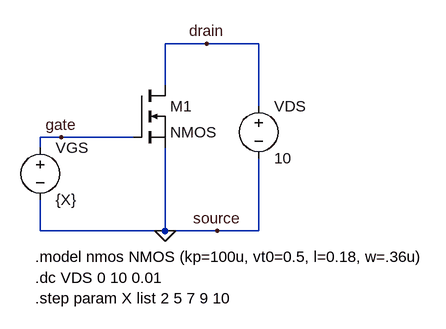
[diagram p0: schematic part2_a_1.asc]
part2_a_1.asc, the LTspice schematic file:
Version 4
SHEET 1 880 680
WIRE 160 48 96 48
WIRE 240 48 160 48
WIRE 96 112 96 48
WIRE 240 144 240 48
WIRE -64 192 -96 192
WIRE 48 192 -64 192
WIRE -96 208 -96 192
WIRE -96 336 -96 288
WIRE 96 336 96 208
WIRE 96 336 -96 336
WIRE 176 336 96 336
WIRE 240 336 240 224
WIRE 240 336 176 336
FLAG 96 336 0
FLAG -64 192 gate
FLAG 160 48 drain
FLAG 176 336 source
SYMBOL voltage -96 192 R0
SYMATTR InstName VGS
SYMATTR Value {X}
SYMBOL voltage 240 128 R0
SYMATTR InstName VDS
SYMATTR Value 10
SYMBOL nmos 48 112 R0
SYMATTR InstName M1
TEXT -104 376 Left 2 !.model nmos NMOS (kp=100u, vt0=0.5, l=0.18, w=.36u)
TEXT -104 408 Left 2 !.dc VDS 0 10 0.01
TEXT -104 440 Left 2 !.step param X list 2 5 7 9 10

The netlist it stands for:
* part2_a_1.asc
VGS gate 0 {X}
VDS drain 0 10
M1 drain gate 0 0 NMOS
.model NMOS NMOS
.model PMOS PMOS
.lib standard.mos
.model nmos NMOS (kp=100u, vt0=0.5, l=0.18, w=.36u)
.dc VDS 0 10 0.01
.step param X list 2 5 7 9 10
.backanno
.end

* Results of the author's LTspice run, read from the files saved beside the schematic
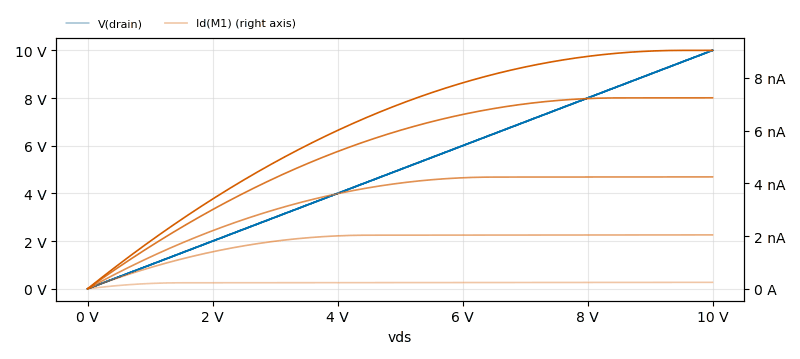
[diagram p1: DC transfer characteristic of part2_a_1.asc, plotted from the saved traces]
* DC transfer characteristic, 5 runs:
*   V(drain) [x=2]: 0 V at vds=0 V, 10 V at vds=10 V, min 0 V, max 10 V
*   V(drain) [x=5]: 0 V at vds=0 V, 10 V at vds=10 V, min 0 V, max 10 V
*   V(drain) [x=7]: 0 V at vds=0 V, 10 V at vds=10 V, min 0 V, max 10 V
*   V(drain) [x=9]: 0 V at vds=0 V, 10 V at vds=10 V, min 0 V, max 10 V
*   V(drain) [x=10]: 0 V at vds=0 V, 10 V at vds=10 V, min 0 V, max 10 V
*   Id(M1) [x=2]: 0 A at vds=0 V, 245 pA at vds=10 V, min 0 A, max 245 pA
*   Id(M1) [x=5]: 0 A at vds=0 V, 2.045 nA at vds=10 V, min 0 A, max 2.045 nA
*   Id(M1) [x=7]: 0 A at vds=0 V, 4.245 nA at vds=10 V, min 0 A, max 4.245 nA
*   Id(M1) [x=9]: 0 A at vds=0 V, 7.245 nA at vds=10 V, min 0 A, max 7.245 nA
*   Id(M1) [x=10]: 0 A at vds=0 V, 9.045 nA at vds=10 V, min 0 A, max 9.045 nA